# EAGLE schematic Radial-V Ext (EAGLE 7.4.0)
Extension Board for Radial-V.
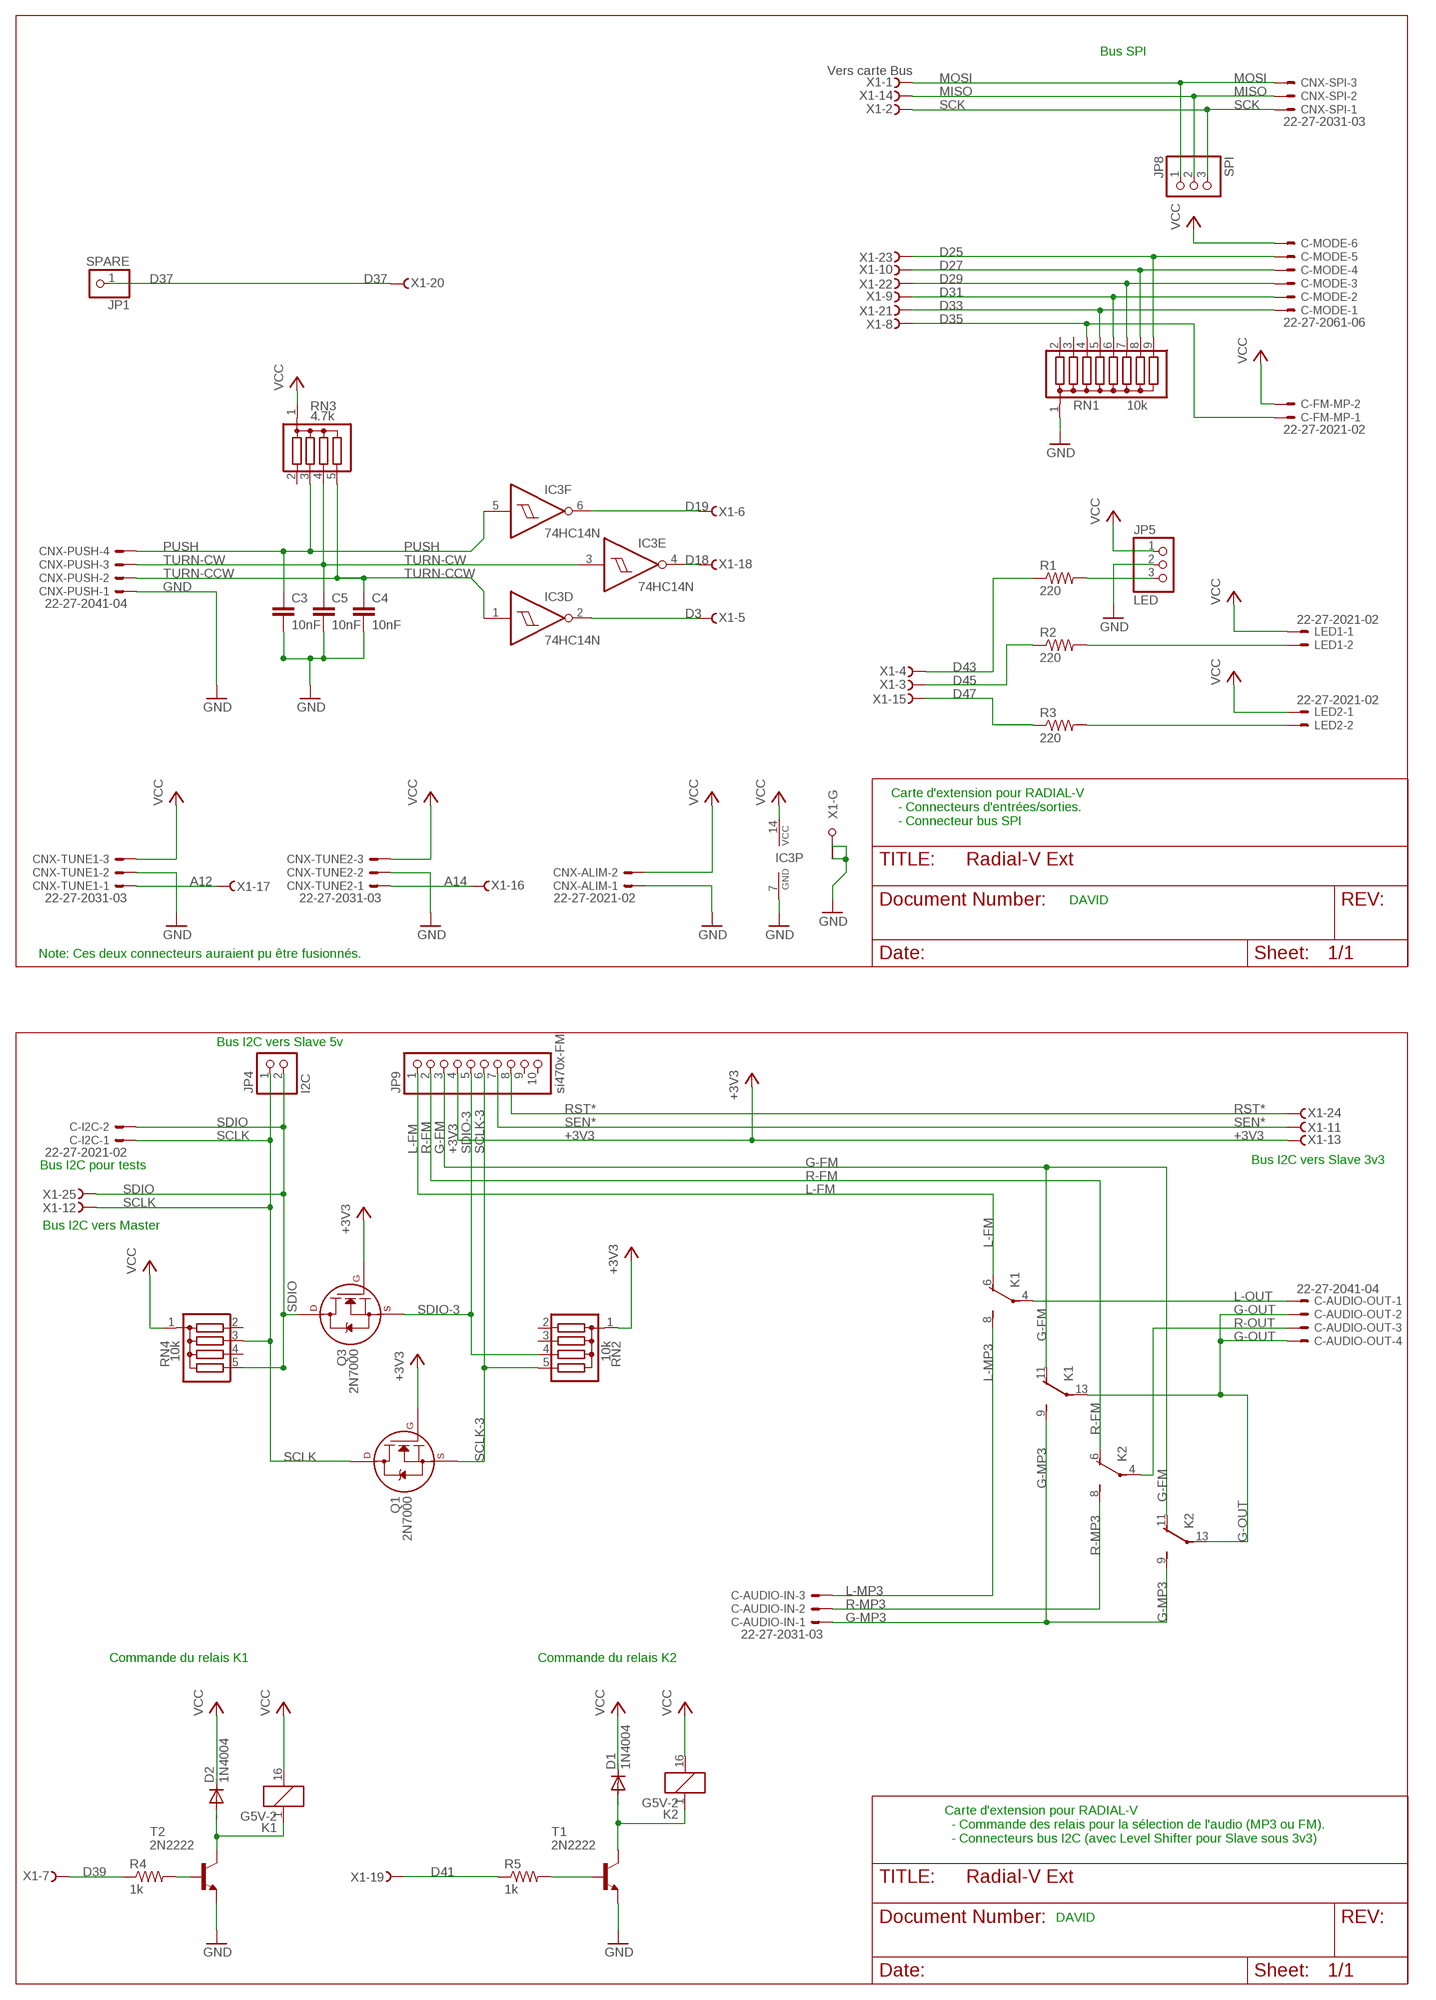
[diagram p0: schematic, sheet 1]

## Parts
C3  10nF  C-EU050-050X075  [C050-050X075]
C4  10nF  C-EU050-050X075  [C050-050X075]
C5  10nF  C-EU050-050X075  [C050-050X075]
C-AUDIO-IN  22-27-2031-03  [6410-03]
C-AUDIO-OUT  22-27-2041-04  [6410-04]
C-FM-MP  22-27-2021-02  [6410-02]
C-I2C  22-27-2021-02  [6410-02]
C-MODE  22-27-2061-06  [6410-06]
CNX-ALIM  22-27-2021-02  [6410-02]
CNX-PUSH  22-27-2041-04  [6410-04]
CNX-SPI  22-27-2031-03  [6410-03]
CNX-TUNE1  22-27-2031-03  [6410-03]
CNX-TUNE2  22-27-2031-03  [6410-03]
D1  1N4004  [DO41-10]
D2  1N4004  [DO41-10]
IC3  74HC14N  [DIL14]
JP1  SPARE  PINHD-1X1  [1X01]
JP4  I2C  PINHD-1X2  [1X02]
JP5  LED  PINHD-1X3  [1X03]
JP8  SPI  PINHD-1X3  [1X03]
JP9  si470x-FM  PINHD-1X10  [1X10]
K1  G5V-2  [G5V-2]
K2  G5V-2  [G5V-2]
LED1  22-27-2021-02  [6410-02]
LED2  22-27-2021-02  [6410-02]
Q1  2N7000  2N7000_TO92  [TO-92]
Q3  2N7000  2N7000_TO92  [TO-92]
R1  220  R-US_0411/15  [0411/15]
R2  220  R-US_0411/15  [0411/15]
R3  220  R-US_0411/15  [0411/15]
R4  1k  R-US_0411/15  [0411/15]
R5  1k  R-US_0411/15  [0411/15]
RN1  10k  G08R  [SIL9]
RN2  10k  G04R  [SIL5]
RN3  4.7k  G04R  [SIL5]
RN4  10k  G04R  [SIL5]
T1  2N2222  [TO18]
T2  2N2222  [TO18]
X1  Vers carte Bus  F25HPS  [F25HP]

## Nets
+3V3: JP9.4 Q1.2(G) Q3.2(G) RN2.1 X1.13(-13:F)
A12: CNX-TUNE1.1 X1.17(-17:F)
A14: CNX-TUNE2.1 X1.16(-16:F)
D3: IC3.2(D:O) X1.5(-5:F)
D18: IC3.4(E:O) X1.18(-18:F)
D19: IC3.6(F:O) X1.6(-6:F)
D25: C-MODE.5 RN1.9 X1.23(-23:F)
D27: C-MODE.4 RN1.8 X1.10(-10:F)
D29: C-MODE.3 RN1.7 X1.22(-22:F)
D31: C-MODE.2 RN1.6 X1.9(-9:F)
D33: C-MODE.1 RN1.5 X1.21(-21:F)
D35: C-FM-MP.1 RN1.4 X1.8(-8:F)
D37: JP1.1 X1.20(-20:F)
D39: R4.1 X1.7(-7:F)
D41: R5.1 X1.19(-19:F)
D43: R1.1 X1.4(-4:F)
D45: R2.1 X1.3(-3:F)
D47: R3.1 X1.15(-15:F)
G-FM: JP9.3 K1.11(2:O) K2.11(2:O)
G-MP3: C-AUDIO-IN.1 K1.9(2:S) K2.9(2:S)
G-OUT: C-AUDIO-OUT.2 C-AUDIO-OUT.4 K1.13(2:P) K2.13(2:P)
GND [power]: C3.2 C4.2 C5.2 CNX-ALIM.1 CNX-PUSH.1 CNX-TUNE1.2 CNX-TUNE2.2 IC3.7(P:GND) JP5.2 RN1.1 T1.1(E) T2.1(E) X1.G1(-G:G1) X1.G2(-G:G2)
L-FM: JP9.1 K1.6(1:O)
L-MP3: C-AUDIO-IN.3 K1.8(1:S)
L-OUT: C-AUDIO-OUT.1 K1.4(1:P)
MISO: CNX-SPI.2 JP8.2 X1.14(-14:F)
MOSI: CNX-SPI.3 JP8.1 X1.1(-1:F)
N$1: D2.A K1.1 T2.3(C)
N$2: LED1.2 R2.2
N$7: D1.A K2.1 T1.3(C)
N$9: JP5.3 R1.2
N$12: LED2.2 R3.2
N$19: R4.2 T2.2(B)
N$20: R5.2 T1.2(B)
PUSH: C3.1 CNX-PUSH.4 IC3.5(F:I) RN3.3
R-FM: JP9.2 K2.6(1:O)
R-MP3: C-AUDIO-IN.2 K2.8(1:S)
R-OUT: C-AUDIO-OUT.3 K2.4(1:P)
RST*: JP9.8 X1.24(-24:F)
SCK: CNX-SPI.1 JP8.3 X1.2(-2:F)
SCLK: C-I2C.1 JP4.1 Q1.3(D) RN4.3 X1.12(-12:F)
SCLK-3: JP9.6 Q1.1(S) RN2.5
SDIO: C-I2C.2 JP4.2 Q3.3(D) RN4.5 X1.25(-25:F)
SDIO-3: JP9.5 Q3.1(S) RN2.4
SEN*: JP9.7 X1.11(-11:F)
TURN-CCW: C4.1 CNX-PUSH.2 IC3.1(D:I) RN3.5
TURN-CW: C5.1 CNX-PUSH.3 IC3.3(E:I) RN3.4
VCC [power]: C-FM-MP.2 C-MODE.6 CNX-ALIM.2 CNX-TUNE1.3 CNX-TUNE2.3 D1.C D2.C IC3.14(P:VCC) JP5.1 K1.16 K2.16 LED1.1 LED2.1 RN3.1 RN4.1
Unconnected: IC3.8(C:O) IC3.9(C:I) IC3.10(B:O) IC3.11(B:I) IC3.12(A:O) IC3.13(A:I) JP9.9 JP9.10 RN1.2 RN1.3 RN2.2 RN2.3 RN3.2 RN4.2 RN4.4

## Notes on the sheet
- Bus SPI
- Carte d'extension pour RADIAL-V
    - Connecteurs d'entrées/sorties.
    - Connecteur bus SPI
- DAVID
- Note: Ces deux connecteurs auraient pu être fusionnés.
- Bus I2C vers Slave 5v
- Bus I2C vers Slave 3v3
- Bus I2C pour tests
- Bus I2C vers Master
- Commande du relais K1 | Commande du relais K2
- Carte d'extension pour RADIAL-V
    - Commande des relais pour la sélection de l'audio (MP3 ou FM).
    - Connecteurs bus I2C (avec Level Shifter pour Slave sous 3v3)
- DAVID

## Library data of the parts
C3-C5 = rcl:C-EU: CAPACITOR, European symbol
C-AUDIO-IN CNX-TUNE1 CNX-TUNE2 = con-molex:22-?-03: CONNECTOR wire to board 2.54 mm (.1 inch) pitch header; OC_FARNELL: 2366181; OC_NEWARK: unknown
C-AUDIO-OUT CNX-PUSH = con-molex:22-?-04: CONNECTOR wire to board 2.54 mm (.1 inch) pitch header; OC_FARNELL: unknown; OC_NEWARK: unknown
C-FM-MP C-I2C CNX-ALIM LED1 LED2 = con-molex:22-?-02: CONNECTOR wire to board 2.54 mm (.1 inch) pitch header; OC_FARNELL: unknown; OC_NEWARK: unknown
C-MODE = con-molex:22-?-06: CONNECTOR wire to board 2.54 mm (.1 inch) pitch header; OC_FARNELL: unknown; OC_NEWARK: unknown
CNX-SPI = con-molex:22-?-03: CONNECTOR wire to board 2.54 mm (.1 inch) pitch header; OC_FARNELL: unknown; OC_NEWARK: unknown
D1 D2 = diode:1N4004: DIODE general purpose rectifier, 1 A
IC3 = 74xx-eu:74*14: Hex schmitt trigger INVERTER
JP1 = pinhead:PINHD-1X1: PIN HEADER
JP4 = pinhead:PINHD-1X2: PIN HEADER
JP5 JP8 = pinhead:PINHD-1X3: PIN HEADER
JP9 = pinhead:PINHD-1X10: PIN HEADER
K1 K2 = relay:G5V-2: OMRON PCB Relay Source: http://www.omron.com/ecb/products/pdf/en-g5v2.pdf; MPN: G5V-2 5DC; OC_FARNELL: 9949488; OC_NEWARK: 78K5703
Q1 Q3 = transistors:2N700*: 2N7000, 2N7002, NDS7002A N-channel enhancement mode MOSFET
R1-R5 = rcl:R-US_: RESISTOR, American symbol
RN1 = resistor-sil:G08R: SIL RESISTOR; OC_FARNELL: unknown; OC_NEWARK: unknown
RN2-RN4 = resistor-sil:G04R: SIL RESISTOR; OC_FARNELL: unknown; OC_NEWARK: unknown
T1 T2 = transistor:2N2222: NPN TRANSISTOR
X1 = con-subd:F25HPS: SUB-D; OC_FARNELL: unknown; OC_NEWARK: unknown

## Net classes
0 default: width 0.406 mm, drill 0.787 mm, clearance 0.279 mm
1 power: width 0.813 mm, drill 0.787 mm, clearance 0.279 mm